# Altium schematic sheet Sheet1.SchDoc
size A3; SheetNumber: 2; SheetTotal: 2
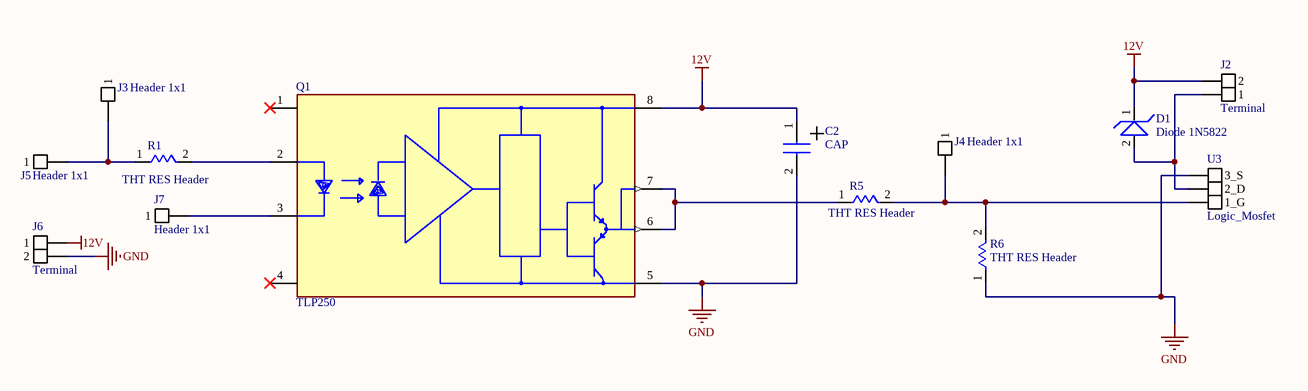
[diagram p0: Sheet1.SchDoc]

## Parts
C2  CAP  [Cap 5x10]
D1  Diode 1N5822  [Diode]
J2  Terminal  [Terminal]
J3  Header 1x1  [Header 1x1]
J4  Header 1x1  [Header 1x1]
J5  Header 1x1  [Header 1x1]
J6  Terminal  [Terminal]
J7  Header 1x1  [Header 1x1]
Q1  TLP250  [FP-11-10C4-MFG]
R1  THT RES Header  [Res]
R5  THT RES Header  [Res]
R6  THT RES Header  [Res]
U3  Logic_Mosfet  [Logic_Mosfet]

## Nets
12V: C2.1 D1.1 J2.2 J6.1 Q1.8(VCC)
GND: C2.2 J6.2 Q1.5(GND) R6.1 U3.3(3_S)
NetD1_2: D1.2 J2.1 U3.2(2_D)
NetJ3_1: J3.1 J5.1 R1.1
NetJ4_1: J4.1 R5.2 R6.2 U3.1(1_G)
NetJ7_1: J7.1 Q1.3(C)
NetQ1_2: Q1.2(A) R1.2
NetQ1_6: Q1.6(VO(Output)) Q1.7(VO) R5.1

Not connected (* = marked no-connect by the designer): Q1 1(NC)* 4(NC)*

## Library data of the parts
C2 = CAP: Capacitor; ComponentLink1Description: Satın Alma Linki; ComponentLink1URL: https://www.robotistan.com/10nf-seramik-kondansator-paketi-10-adet; ComponentLink2Description: Satın Alma Linki; ComponentLink2URL: https://www.robotistan.com/1nf-seramik-kondansator-paketi-10-adet
D1 = Diode 1N5822 SMD: SS34 1N5822 SMD Schottky Diode 3A 40V; ComponentLink1Description: Satın Alma Linki; ComponentLink1URL: https://bbcelektronik.com/diyot-diod-cesitleri/diyot-ve-kopru-diyot/prd-1n5819-1-amper-40-volt-smd-diyot-schottky-diyot-ss14-bbc13770; ComponentLink2Description: Datashhets; ComponentLink2URL: http://www.kesenes.com/pdf/1n5817-1n5819.pdf
J3-J5 J7 = Header 1x1: Header; ComponentLink3Description: Satın Alma Linki; ComponentLink3URL: https://www.robotistan.com/1x40-180-12mm
Q1 = CMP-35887-000009-1: Optocoupler Drive Push-Pull 1-CH 30V 600V 8-Pin PDIP; Manufacturer: TOSHIBA; Standoff Height: 0.55mm; Turn Off Delay Time: 0.15us; Max Junction Temp: +125°C; Power Dissipation: 800mW; Forward Current: 10mA; Reverse Voltage: 5V; Forward Voltage: 1.6V; Isolation Voltage: 2500Vrms; Min Supply Voltage: 10V; ComponentLink2Description: Datasheet; Octopart: https://octopart.com/tlp-250-toshiba-99104964; Automotive: No; Temperature Range High: +85°C; Lead Free: Yes; Package: 11-10C4; Category: Trans; Temperature Range Low: -20°C; Ipc Land Pattern Name: DIP762W50P254L966H445Q8; ComponentLink2URL: https://toshiba.semicon-storage.com/info/docget.jsp?did=16821&prodName=TLP250; Device Class L3: unset; Turn On Delay Time: 0.15us; Device Class L2: Optocouplers; Manufacturer Part Number: TLP250; Max Supply Voltage: 30V; Height: 4.85mm; Device Class L1: Optoelectronics; Temperature: -20°C to +85°C; RoHS: TRUE
R1 R5 R6 = THT RES Header: THT RES; ComponentLink1Description: Satın Alma Linki; ComponentLink1URL: https://www.robotistan.com/14w-10k-direnc-paketi-10-adet; ComponentLink2Description: Satın Alma Linki; ComponentLink2URL: https://www.robotistan.com/14w-56k-direnc-paketi-10-adet; ComponentLink3Description: Satın Alma Linki; ComponentLink3URL: https://www.robotistan.com/14w-1k-direnc-paketi-10-adet; ComponentLink4Description: Satın Alma Linki; ComponentLink4URL: https://www.robomarket.com.tr/6-2k-direnc-1-adet-1-4w; ComponentLink5Description: Satın Alma Linki; ComponentLink5URL: https://www.robotistan.com/12w-75k-10-adet; ComponentLink6Description: Satın Alma Linki; ComponentLink6URL: https://www.direnc.net/75k-14w-metalfilm-direnc-paketi-100-adet-1?language=tr&h=cb2d2062; ComponentLink7Description: Satın Alma Linki; ComponentLink7URL: https://www.robotistan.com/14w-4k7-direnc-paketi-10-adet; ComponentLink8Description: Satın Alma Linki; ComponentLink8URL: https://www.robotistan.com/2w-120k; ComponentLink9Description: Satın Alma Linki; ComponentLink9URL: https://www.robotistan.com/14w-3k9-direnc-paketi-10-adet?language=tr&h=0f40f5ee&gclid=CjwKCAjwxOCRBhA8EiwA0X8hi8jDuTXAWIdHih4LhQcB3YXTjEJ8OgB0uW3rlfstCae65K6p5gflnBoC2EgQAvD_BwE; ComponentLink10Description: Satın Alma Linki; ComponentLink10URL: https://www.motorobit.com/urun/3-3m-1-4w-direnc-10-adet
J2 J6 = Terminal: ComponentLink1Description: Satın Alma Linki; ComponentLink1URL: *; ComponentLink2Description: Datasheet; ComponentLink2URL: *
U3 = Logic_Mosfet: ComponentLink1Description: Satın Alma Linki; ComponentLink1URL: https://www.robotistan.com/buz101l-29a-50v-mosfet-logl-logic-level-to220?language=tr&h=3cb70a68; ComponentLink2Description: Satın Alma Linki; ComponentLink2URL: https://www.robolinkmarket.com/buz101l-29a-50v-mosfet-logl-logic-level-to220-mosfet; ComponentLink3Description: Datasheet; ComponentLink3URL: https://www.robolinkmarket.com/Data/EditorFiles/PDF/buz101l.pdf; ComponentLink4Description: Satın Alma Linki; ComponentLink4URL: https://www.direnc.net/3-pin-508mm-disi-gecmeli-klemens-11943; ComponentLink5Description: Satın Alma Linki; ComponentLink5URL: https://www.direnc.net/3-pin-508mm-90-gecmeli-takim-klemens; ComponentLink6Description: Satın Alma Linki; ComponentLink6URL: https://www.direnc.net/irlz44n-d2pak-smd-n-kanal-mosfet; ComponentLink7Description: Datasheet; ComponentLink7URL: https://pdf.direnc.net/upload/irlz44nslpbf-datasheet.pdf